# Altium schematic sheet shifter.SchDoc
size A4
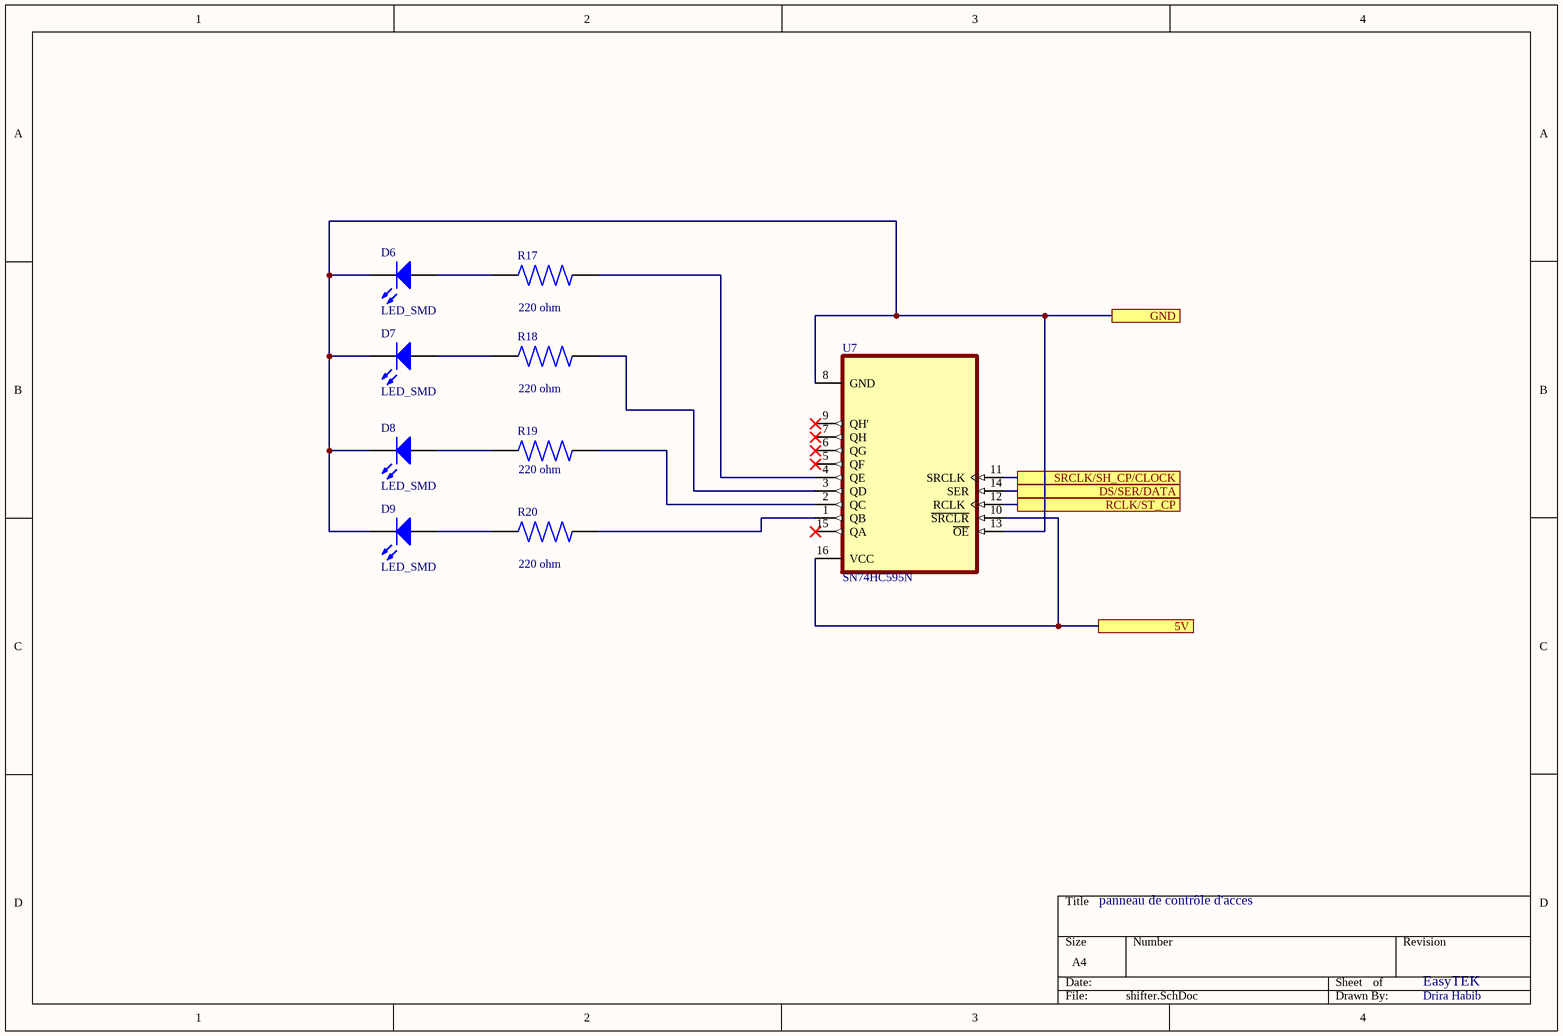
[diagram p0: shifter.SchDoc]

## Parts
D6  LED_SMD  [0603_LED]
D7  LED_SMD  [0603_LED]
D8  LED_SMD  [0603_LED]
D9  LED_SMD  [0603_LED]
R17  value 220 ohm  [RES_ERA2APB221X]  (hidden comment: ERA2APB221X)
R18  value 220 ohm  [RES_ERA2APB221X]  (hidden comment: ERA2APB221X)
R19  value 220 ohm  [RES_ERA2APB221X]  (hidden comment: ERA2APB221X)
R20  value 220 ohm  [RES_ERA2APB221X]  (hidden comment: ERA2APB221X)
U7  SN74HC595N  [DIP794W45P254L1969H508Q16]

## Ports
5V, DS/SER/DATA, GND, RCLK/ST_CP, SRCLK/SH_CP/CLOCK

## Nets
5V: U7.10(~{SRCLR}) U7.16(VCC) ; port 5V
DS/SER/DATA: U7.14(SER) ; port DS/SER/DATA
GND: D6.2(K) D7.2(K) D8.2(K) D9.2(K) U7.8(GND) U7.13(~{OE}) ; port GND
RCLK/ST_CP: U7.12(RCLK) ; port RCLK/ST_CP
SRCLK/SH_CP/CLOCK: U7.11(SRCLK) ; port SRCLK/SH_CP/CLOCK
NetD6_1: D6.1(A) R17.1
NetD7_1: D7.1(A) R18.1
NetD8_1: D8.1(A) R19.1
NetD9_1: D9.1(A) R20.1
NetR17_2: R17.2 U7.4(QE)
NetR18_2: R18.2 U7.3(QD)
NetR19_2: R19.2 U7.2(QC)
NetR20_2: R20.2 U7.1(QB)

Not connected (* = marked no-connect by the designer): U7 5(QF)* 6(QG)* 7(QH)* 9(QH')* 15(QA)*

## Notes on the sheet
- panneau de contrôle d'acces
- EasyTEK
- Drira Habib

## Library data of the parts
D6-D9 = LED_SMD: LED RED CLEAR 0603 SMD; Manufacturer Part Number: LTST-C191KRKT; PackageReference: 0603 (1608 Metric); PackageDescription: 1.60mm L x 0.80mm W; Digikey Part Number: 160-1447-1-ND; Value: RED
R17-R20 = ERA2APB221X: Availability: Unavailable; MP: ERA2APB221X; Price: None; Package: None
U7 = SN74HC595N: Package: None; Price: None; Availability: Unavailable; MP: SN74HC595N; Value: *